# Altium schematic sheet MC3202.SchDoc
size A; SheetNumber: 9; SheetTotal: 13
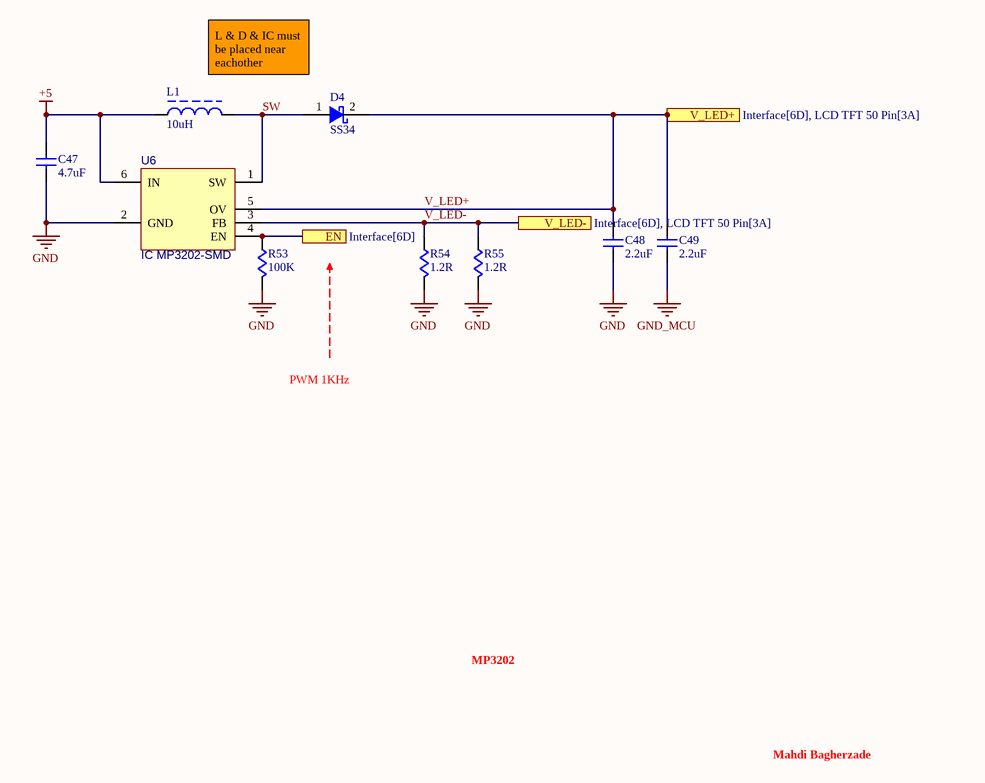
[diagram p0: MC3202.SchDoc]

## Parts
C47  value 4.7uF  [C-0805]  (hidden comment: CAP Cer 4.7uF-16V-X7R-SMD)
C48  value 2.2uF  [C-0805]  (hidden comment: CAP Cer 2.2uF-25V-X7R-SMD)
C49  value 2.2uF  [C-0805]  (hidden comment: CAP Cer 2.2uF-25V-X7R-SMD)
D4  Code: SS34  [D-DO214AB]  (hidden comment: Diode Schottky SS34-SMD)
L1  value 10uH  [IND-SMD-1010]  (hidden comment: IND 10uH-10x10mm-SMD)
R53  value 100K  [R-0805]  (hidden comment: RES 100K-5%-1/8W-SMD)
R54  value 1.2R  [R-1206]  (hidden comment: RES 1.2R-5%-1/8W-SMD)
R55  value 1.2R  [R-1206]  (hidden comment: RES 1.2R-5%-1/8W-SMD)
U6  IC MP3202-SMD  [SOT23-6N]

## Ports
EN (see Interface[6D]), V_LED+ (see Interface[6D], LCD TFT 50 Pin[3A]), V_LED- (see Interface[6D], LCD TFT 50 Pin[3A])

## Nets
+5: C47.1 L1.1 U6.6(IN)
GND: C47.2 C48.2 R53.2 R54.2 R55.2 U6.2(GND)
GND_MCU: C49.2
EN: R53.1 U6.4(EN) ; port EN
SW: D4.1(A) L1.2 U6.1(SW)
V_LED+: C48.1 C49.1 D4.2(C) U6.5(OV) ; port V_LED+
V_LED-: R54.1 R55.1 U6.3(FB) ; port V_LED-

## Notes on the sheet
- L & D & IC must be placed near eachother
- PWM 1KHz
- MP3202
- Mahdi Bagherzade

## Library data of the parts
C47 = CAP-CER: CAPACITOR; Phone Number: 0915 8700 314; Voltage: 16V; Tolerance: X7R; Type: SMD; Publisher: Mahdi Bagherzadeh; ComponentLink1Description: Linkedin; ComponentLink1URL: https://ir.linkedin.com/in/mahdi-bagherzade; Published Date: 9-15-2024
C48 C49 = CAP-CER: CAPACITOR; Phone Number: 0915 8700 314; Voltage: 25V; Tolerance: X7R; Type: SMD; Publisher: Mahdi Bagherzadeh; ComponentLink1Description: Linkedin; ComponentLink1URL: https://ir.linkedin.com/in/mahdi-bagherzade; Published Date: 9-15-2024
D4 = DIODE-SCHOTTKY: DIODE; Phone Number: 0915 8700 314; Type: SMD; Publisher: Mahdi Bagherzadeh; ComponentLink1Description: Linkedin; ComponentLink1URL: https://ir.linkedin.com/in/mahdi-bagherzade; Published Date: 9-15-2024
L1 = INDUCATOR: Phone Number: 0915 8700 314; Type: SMD; Publisher: Mahdi Bagherzadeh; ComponentLink1Description: Linkedin; ComponentLink1URL: https://ir.linkedin.com/in/mahdi-bagherzade; Published Date: 9-15-2024; Size: 10x10mm
R53-R55 = RES: RESISTOR; Phone Number: 0915 8700 314; Tolerance: 5%; Power: 1/8W; Publisher: Mahdi Bagherzadeh; ComponentLink1Description: Linkedin; ComponentLink1URL: https://ir.linkedin.com/in/mahdi-bagherzade; Published Date: 9-15-2024; Type: SMD
U6 = MP3202: IC; Phone Number: 0915 8700 314; Publisher: Mahdi Bagherzadeh; Published Date: 7-2-2026; Code: MP3202; Type: SMD